# EAGLE schematic sequencer (EAGLE 7.6.0)
DESIGNER: Charles Julian Knight
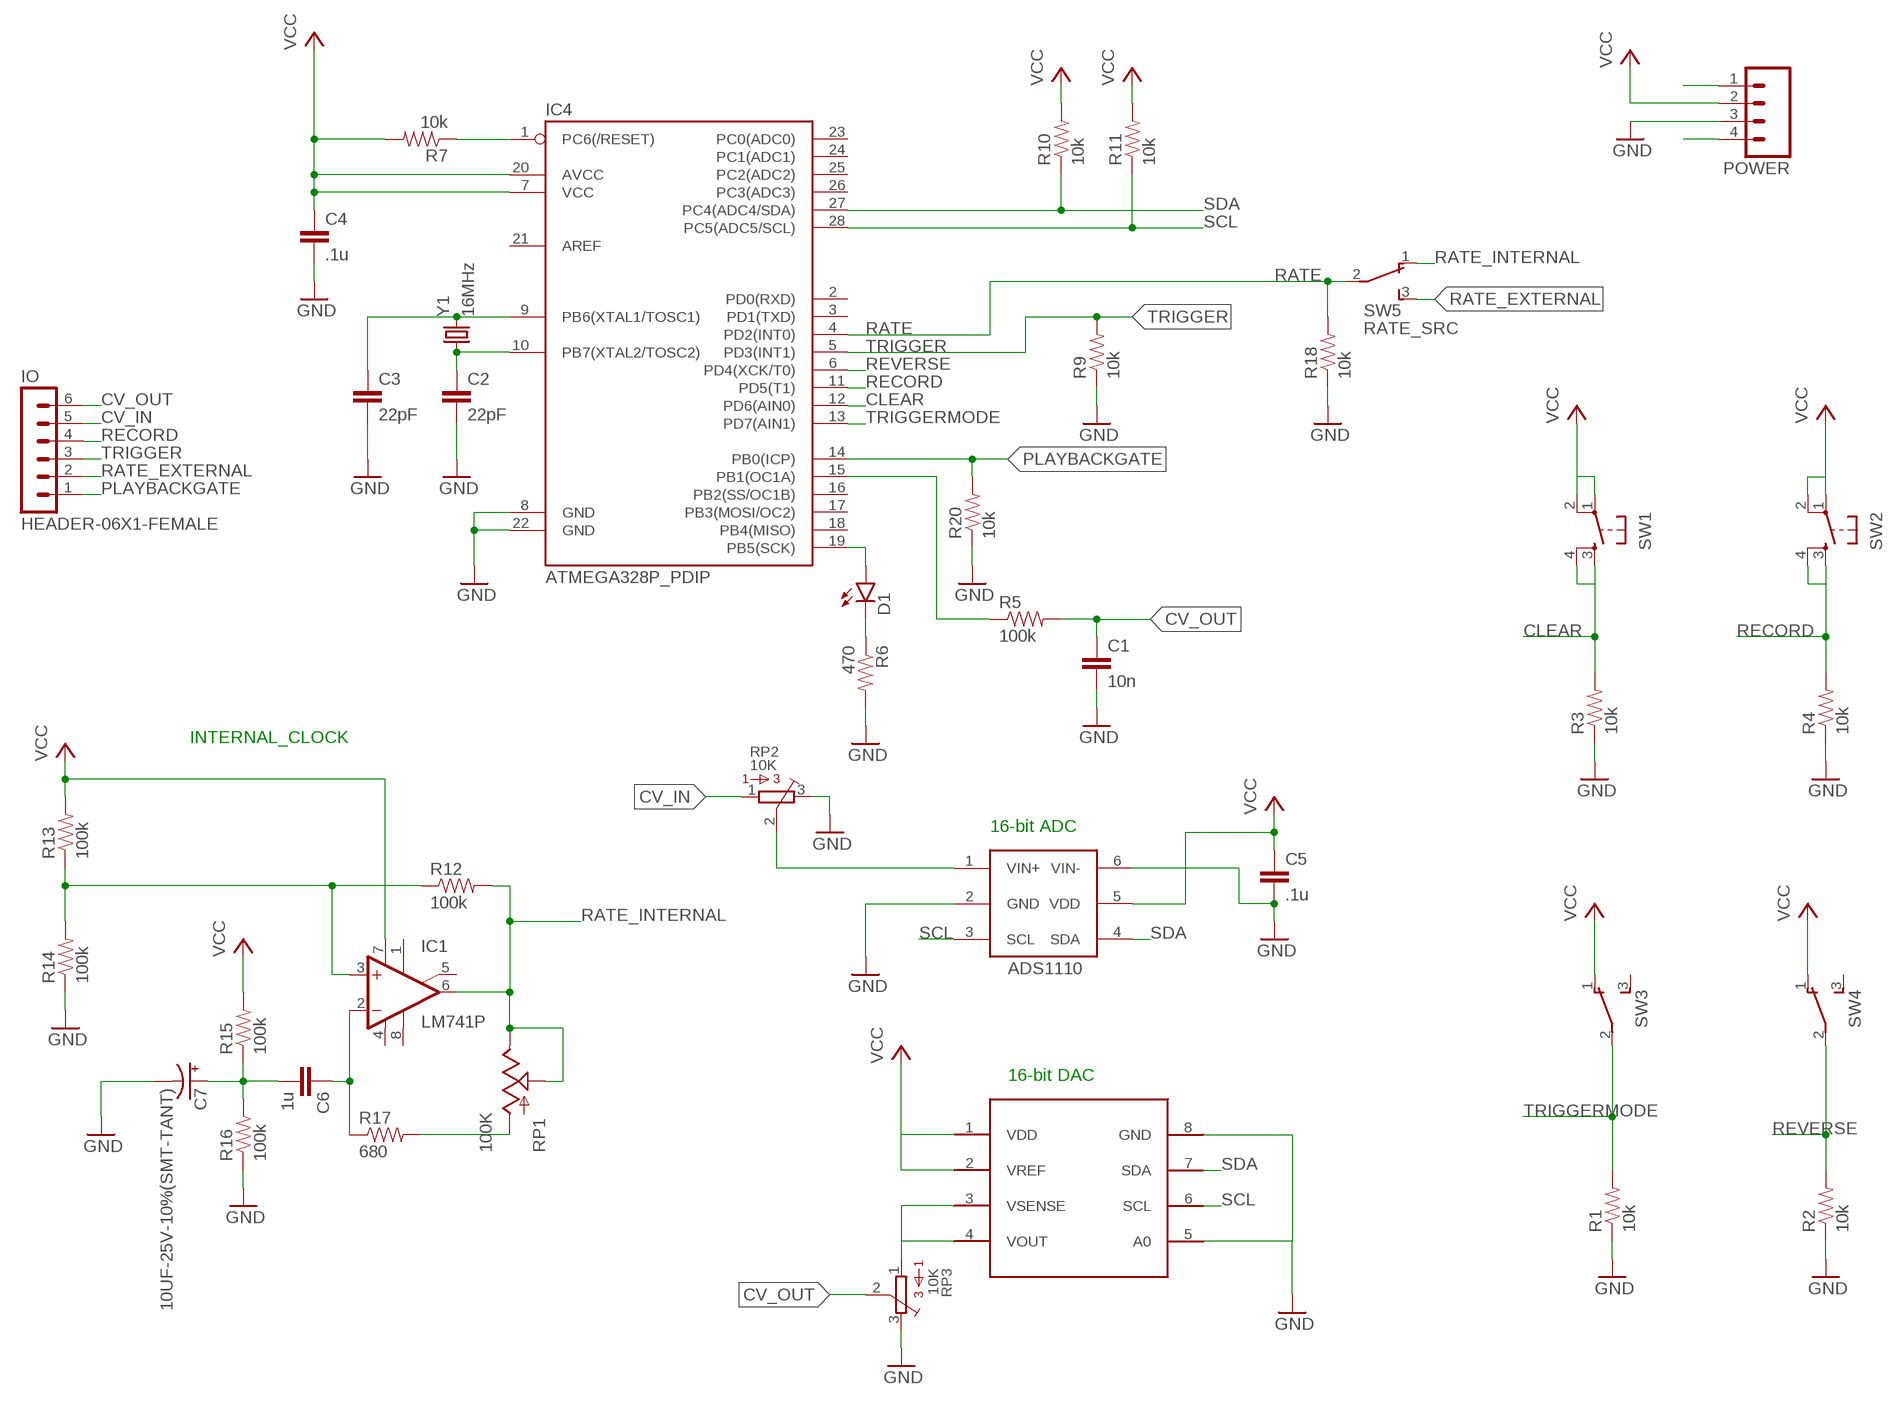
[diagram p0: schematic, sheet 1]

## Parts
C1  10n  CAP1206  [1206]
C2  22pF  CAP1206  [1206]
C3  22pF  CAP1206  [1206]
C4  .1u  CAP1206  [1206]
C5  .1u  CAP1206  [1206]
C6  1u  CAP1206  [1206]
C7  10UF-25V-10%(SMT-TANT)  [EIA6032-NOM]
D1  LED-3MM-NO_SILK  [LED3MM-NS]
IC1  LM741P  [DIL08]
IC2  ADS1110  [SOT-23-6]
IC3  DAC8571  [8MSOP]
IC4  ATMEGA328P_PDIP  [DIL28-3]
IO  HEADER-06X1-FEMALE  [06X1-PTH]
POWER  M04PTH  [1X04]
R1  10k  RESISTOR1206  [1206]
R2  10k  RESISTOR1206  [1206]
R3  10k  RESISTOR1206  [1206]
R4  10k  RESISTOR1206  [1206]
R5  100k  RESISTOR1206  [1206]
R6  470  RESISTOR1206  [1206]
R7  10k  RESISTOR1206  [1206]
R9  10k  RESISTOR1206  [1206]
R10  10k  RESISTOR1206  [1206]
R11  10k  RESISTOR1206  [1206]
R12  100k  RESISTOR1206  [1206]
R13  100k  RESISTOR1206  [1206]
R14  100k  RESISTOR1206  [1206]
R15  100k  RESISTOR1206  [1206]
R16  100k  RESISTOR1206  [1206]
R17  680  RESISTOR1206  [1206]
R18  10k  RESISTOR1206  [1206]
R20  10k  RESISTOR1206  [1206]
RP1  100K  POTALPS-KIT  [ALPS_POT_KIT]
RP2  10K  3386-P  [3386P]
RP3  10K  3386-P  [3386P]
SW1  TAC_SWITCHPTH  [TACTILE-PTH]
SW2  TAC_SWITCHPTH  [TACTILE-PTH]
SW3  TL36YO  [TL3XYO]
SW4  TL36YO  [TL3XYO]
SW5  RATE_SRC  TL36YO  [TL3XYO]
Y1  16MHz  CRYSTALHC49US  [HC49US]

## Nets
CLEAR: IC4.12(PD6(AIN0)) R3.2 SW1.3 SW1.4
CV_IN: IO.5 RP2.1
CV_OUT: C1.1 IO.6 R5.2 RP3.2
DIRECT_IN: IC2.1(VIN+) RP2.2
GND: C1.2 C2.2 C3.2 C4.2 C5.2 C7.C(-) IC2.2(GND) IC2.6(VIN-) IC3.5(A0) IC3.8(GND) IC4.8(GND) IC4.22(GND) POWER.3 R1.1 R2.1 R3.1 R4.1 R6.2 R9.1 R14.1 R16.1 R18.1 R20.1 RP2.3 RP3.3
N$1: IC4.15(PB1(OC1A)) R5.1
N$2: IC3.3(VSENSE) IC3.4(VOUT) RP3.1
N$3: D1.K(C) R6.1
N$5: IC4.1(PC6(/RESET)) R7.1
N$6: C3.1 IC4.9(PB6(XTAL1/TOSC1)) Y1.2
N$7: C2.1 IC4.10(PB7(XTAL2/TOSC2)) Y1.1
N$8: D1.A IC4.19(PB5(SCK))
N$11: POWER.1
N$13: IC1.3(+IN) R12.1 R13.1 R14.2
N$14: POWER.4
N$15: R17.2 RP1.P$3(A)
N$17: C6.2 C7.A(+) R15.1 R16.2
N$18: C6.1 IC1.2(-IN) R17.1
PLAYBACKGATE: IC4.14(PB0(ICP)) IO.1 R20.2
RATE: IC4.4(PD2(INT0)) R18.2 SW5.2(P)
RATE_EXTERNAL: IO.2 SW5.3(S)
RATE_INTERNAL: IC1.6(OUT) R12.2 RP1.P$1(E) RP1.P$2(S) SW5.1(O)
RECORD: IC4.11(PD5(T1)) IO.4 R4.2 SW2.3 SW2.4
REVERSE: IC4.6(PD4(XCK/T0)) R2.2 SW4.2(P)
SCL: IC2.3(SCL) IC3.6(SCL) IC4.28(PC5(ADC5/SCL)) R11.1
SDA: IC2.4(SDA) IC3.7(SDA) IC4.27(PC4(ADC4/SDA)) R10.1
TRIGGER: IC4.5(PD3(INT1)) IO.3 R9.2
TRIGGERMODE: IC4.13(PD7(AIN1)) R1.2 SW3.2(P)
VCC: C4.1 C5.1 IC1.7(V+) IC2.5(VDD) IC3.1(VDD) IC3.2(VREF) IC4.7(VCC) IC4.20(AVCC) POWER.2 R7.2 R10.2 R11.2 R13.2 R15.2 SW1.1 SW1.2 SW2.1 SW2.2 SW3.1(O) SW4.1(O)
Unconnected: IC1.1(ON1) IC1.5(ON2) IC1.8(OPT) IC4.2(PD0(RXD)) IC4.3(PD1(TXD)) IC4.16(PB2(SS/OC1B)) IC4.17(PB3(MOSI/OC2)) IC4.18(PB4(MISO)) IC4.21(AREF) IC4.23(PC0(ADC0)) IC4.24(PC1(ADC1)) IC4.25(PC2(ADC2)) IC4.26(PC3(ADC3)) SW3.3(S) SW4.3(S)

## Notes on the sheet
- INTERNAL_CLOCK
- 16-bit ADC
- 16-bit DAC

## Power pins joined to a net without a drawn wire
V-: IC1.4(V-)

## Library data of the parts
C1-C6 = SparkFun-Capacitors:CAP: Capacitor Standard 0603 ceramic capacitor, and 0.1" leaded capacitor.
C7 = SparkFun-Capacitors:10UF-25V-10%(SMT-TANT): http://www.digikey.com/product-detail/en/T491C106K025AT7280/399-10159-2-ND/3759638; PROD_ID: CAP-12984
D1 = SparkFun-LED:LED: LEDs Standard schematic elements and footprints for 5mm, 3mm, 1206, and 0603 sized LEDs. 5mm - Spark Fun Electronics SKU : COM-00529 (and others)
IC1 = linear:*741: OP AMP
IC2 = ads11xx:ADS1110: Analog/Digital conventer i2c Bus max: 2.048v
IC3 = cjk:DAC8571
IC4 = SparkFun-DigitalIC:ATMEGA328P_PDIP: uC used in the Arduino 32kb flash, 1k EEPROM, 2k SRAM This is the through-hole version of this chip.
IO = GeekAmmo:HEADER-06X1?: 6 x 0.1 inch Header 40x1 0.1inch Male Breakaway header can be used. - 4UCON 00834 <http://www.4uconnector.com/online/SearchPro.asp?FormName=ProSearch&FormAction=search&s_GroupNo=&s_keyword=00834> For female part, if possible use 6 x 1 without breaking.
POWER = SparkFun-Connectors:M04: Header 4 Standard 4-pin 0.1" header. Use with straight break away headers (SKU : PRT-00116), right angle break away headers (PRT-00553), swiss pins (PRT-00743), machine pins (PRT-00117), and female headers (PRT-00115). Molex polarized connector foot print use with SKU : PRT-08231 with associated crimp pins and housings. 1MM SMD Version SKU: PRT-10208
R1-R7 R9-R18 R20 = SparkFun-Passives:RESISTOR: Resistor Basic schematic elements and footprints for 0603, 1206, and PTH resistors.
RP1 = SparkFun-Electromechanical:POT; PROD_ID: RES-09177
RP2 RP3 = bourns:3386-: 3386 Series 3/8" Square Trimmer
SW1 SW2 = SparkFun-Retired:TAC_SWITCH: Momentary Switch Button commonly used for reset or general input. Spark Fun Electronics SKU : COM-00097 SMT- SWCH-08247
SW3-SW5 = switch:TL36YO: TINY SWITCH ON - ON Source: http://www2.produktinfo.conrad.com/datenblaetter/700000-724999/705152-da-01-de-Subminiaturschalter_TL_36YO.pdf
Y1 = SparkFun-FreqCtrl:CRYSTAL: Various standard crystals. Proven footprints.